# EAGLE design avr-smps (EAGLE 5.11)
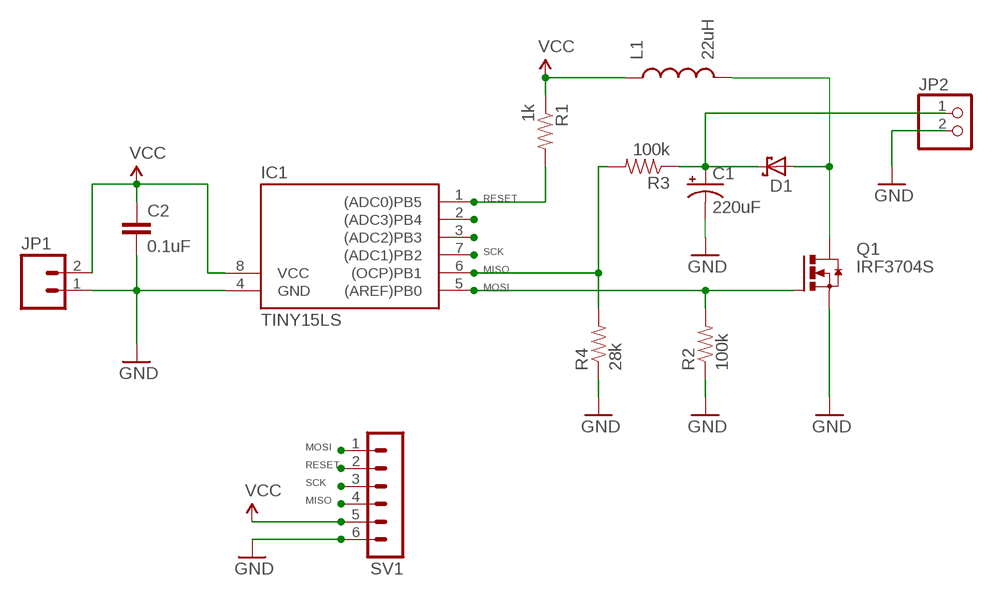
[diagram p0: schematic, sheet 1]

## Parts
C1  220uF  CPOL-US153CLV-0605  [153CLV-0605]
C2  0.1uF  CAP1206  [1206]
D1  SCHOTTKY-DIODESMD  [SMB]
IC1  TINY15LS  [SOIC8]
JP1  M02-JST-2MM-SMT  [JST-2-SMD]
JP2  PINHD-1X2  [1X02]
L1  22uH  INDUCTOR1210  [1210]
Q1  IRF3704S  [D2PACK]
R1  1k  RESISTOR1206  [1206]
R2  100k  RESISTOR1206  [1206]
R3  100k  RESISTOR1206  [1206]
R4  28k  RESISTOR1206  [1206]
SV1  MA06-1  [MA06-1]

## Nets
GND: C1.- C2.2 IC1.4(GND) JP1.1 JP2.2 Q1.3(S) R2.1 R4.1 SV1.6
MISO: IC1.6((OCP)PB1) R3.2 R4.2 SV1.4
MOSI: IC1.5((AREF)PB0) Q1.1(G) R2.2 SV1.1
N$1: IC1.3((ADC2)PB3)
N$2: D1.A L1.2 Q1.2(D)
N$4: C1.+ D1.C JP2.1 R3.1
N$5: IC1.2((ADC3)PB4)
RESET: IC1.1((ADC0)PB5) R1.2 SV1.2
SCK: IC1.7((ADC1)PB2) SV1.3
VCC: C2.1 IC1.8(VCC) JP1.2 L1.1 R1.1 SV1.5

## Notes on the sheet
- RESET
- SCK
- MISO
- MOSI
- MOSI
- RESET
- SCK
- MISO

## Library data of the parts
C1 = rcl:CPOL-US: POLARIZED CAPACITOR, American symbol
C2 = SparkFun:CAP: Capacitor Standard 0603 ceramic capacitor, and 0.1" leaded capacitor.
D1 = diode:SCHOTTKY-DIODE: Schottky Diode
IC1 = atmel:TINY15L: MICROCONTROLLER 2.7 V 1 Kbytes FLASH 64 bytes EEPROM 4-channel 10 bit ADC; OC_FARNELL: unknown; OC_NEWARK: unknown
JP1 = SparkFun:M02: Header 2 Standard 2-pin 0.1" header. Use with straight break away headers (SKU : PRT-00116), right angle break away headers (PRT-00553), swiss pins (PRT-00743), machine pins (PRT-00117), and female headers (PRT-00115). Molex polarized connector foot print use with SKU : PRT-08233 with associated crimp pins and housings.
JP2 = pinhead:PINHD-1X2: PIN HEADER
L1 = SparkFun:INDUCTOR: Inductors Basic Inductor/Choke - 0603 and 1206. Footprints are not proven and vary greatly between part numbers.
Q1 = transistor-power:IRF3704: SMPS MOSFET HEXFET® Power MOSFET Source: http://www.irf.com/product-info/datasheets/data/irf3704.pdf
R1-R4 = SparkFun:RESISTOR: Resistor Basic schematic elements and footprints for 0603, 1206, and PTH resistors.
SV1 = con-lstb:MA06-1: PIN HEADER; OC_FARNELL: unknown; OC_NEWARK: unknown

## Board
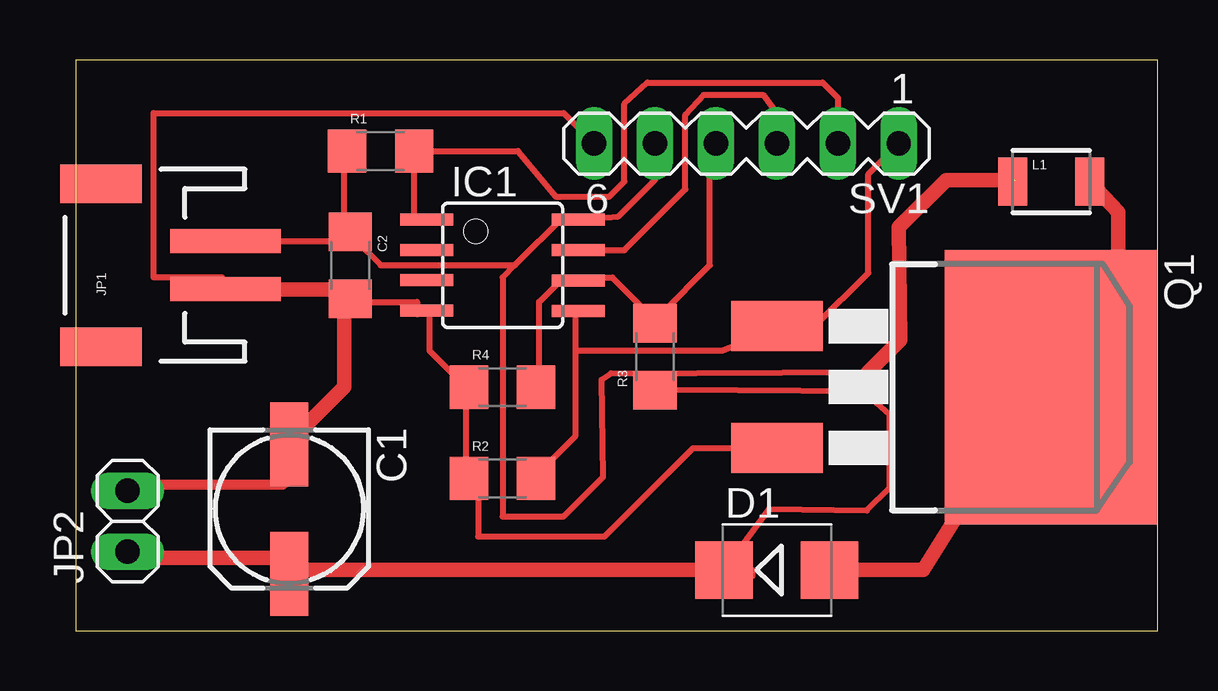
[diagram p1: board, top side]

Size 45.07 x 23.8 mm. Coordinates in mm from the lower left corner, seen from the top.
Outline: 0,0 45.07,0 45.07,23.8 0,23.8 0,0
Copper layers (1*16): Top 0.035mm / dielectric 1.5mm / Bottom 0.035mm
Design rules "default": minimum track width 10mil, minimum drill 24mil, track to track 8mil, track to pad 8mil, pad to pad 8mil, via to via 8mil, smd to smd 8mil, copper to edge 40mil, drill to drill 8mil, minimum pad ring 10mil, minimum via ring 8mil, stop-mask expansion 4mil, vias tented up to drill 0mil, thermal gap 10mil

### Footprints (pad centres in the part's own frame; a part is rotated, then mirrored left to right if it is on the bottom)
153CLV-0605 = smd 3.5 x 1.6: + 2.7,0; - -2.7,0
1206 = smd 1.6 x 1.8: 1 -1.4,0; 2 1.4,0
SMB = smd 2.4 x 2.4: A 2.2,0; C -2.2,0
SOIC8 = smd 0.5 x 2.2: 1 -1.905,-3.154; 2 -0.645,-3.154; 3 0.625,-3.154; 4 1.895,-3.154; 5 1.905,3.154; 6 0.635,3.154; 7 -0.635,3.154; 8 -1.905,3.154
JST-2-SMD = smd 1 x 4.6: 1 -1,-3.7; 2 1,-3.7 | smd 1.6 x 3.4: NC1 -3.4,1.5; NC2 3.4,1.5
1X02 = drill 1.016 long: 1 -1.27,0; 2 1.27,0
1210 = smd 1.2 x 2: 1 -1.6,0; 2 1.6,0
D2PACK = smd 2.083 x 3.81: 1 -2.54,-8.89; 3 2.54,-8.89 | smd 11.43 x 8.89: 2 0,2.54
MA06-1 = drill 1.016 long: 1 -6.35,0; 2 -3.81,0; 3 -1.27,0; 4 1.27,0; 5 3.81,0; 6 6.35,0

### Placement (x,y rotation side)
C1  8.89,5.08 270 top
C2  11.43,15.24 270 top
D1  29.21,2.54 0 top
IC1  17.78,15.24 270 top
JP1  2.54,15.24 90 top
JP2  2.16,4.57 90 top
L1  40.64,18.73 0 top
Q1  38.1,10.16 270 top
R1  12.7,20 0 top
R2  17.78,6.35 0 top
R3  24.13,11.43 90 top
R4  17.78,10.16 0 top
SV1  27.94,20.32 180 top

### Tracks (layer width: path | path; a pad name or v marks a point on that pad's centre or on a via)
GND
  Top 0.254: SV1.6 20.32,21.59 3.24,21.59 3.24,14.73 6.1,14.73 JP1.1 6.6,14.22 | 8.64,6.1 8.64,7.62 C1.- 9.14,8.13 | JP2.2 1.52,6.1 | 16.26,10.16 16.26,6.6 R2.1 16.76,6.1 16.76,3.94 22.04,3.94 25.72,7.62 Q1.3 | C2.2 11.68,13.72 14.22,13.72 14.22,13.21 IC1.4 14.73,13.21 14.73,11.68 16.26,10.16 | 16.26,10.16 R4.1 | 11.18,13.72 C2.2 | C2.2 11.18,14.22
  Top 0.406: 1.52,6.1 8.64,6.1
  Top 0.61: 9.14,8.13 11.18,10.16 11.18,13.72 | 11.18,14.22 6.6,14.22
MISO
  Top 0.254: R4.2 19.3,10.16 19.3,13.72 20.32,14.73 20.83,14.73 IC1.6 21.34,14.73 22.35,14.73 23.88,13.21 R3.2 24.38,13.21 26.42,15.24 26.42,20.32 SV1.4
MOSI
  Top 0.254: 20.83,11.68 20.83,13.21 IC1.5 | 20.83,11.68 20.83,8.13 19.3,6.6 R2.2 | SV1.1 33.02,19.05 33.02,14.92 30.8,12.7 Q1.1 30.48,13.46 29.78,12.83 26.92,11.68 20.83,11.68
N$2
  Top 0.254: 43.43,12.06 Q1.2 41.66,12.7
  Top 0.61: 43.43,12.06 43.43,17.46 L1.2 | 41.66,12.7 35.31,2.54 D1.A
N$4
  Top 0.254: 8.64,3.05 8.64,2.54 C1.+ 9.14,2.54 | JP2.1 1.52,3.05 | R3.1 24.96,10.03 32.83,9.97 33.91,9.02 33.91,5.97 32.96,5.02 28.89,5.08 D1.C | D1.C 28.19,2.54 28.19,2.29 D1.C
  Top 0.61: 1.52,3.05 8.64,3.05 | 9.14,2.54 D1.C
RESET
  Top 0.254: IC1.1 14.1,17.14 14.1,20.19 R1.2 18.41,20 20,18.1 22.23,18.1 22.86,18.73 22.86,21.97 23.81,22.86 31.11,22.86 31.75,22.23 SV1.2
SCK
  Top 0.254: IC1.7 20.83,15.88 | IC1.7 22.86,15.88 25.4,18.41 25.4,21.53 26.16,22.35 28.64,22.35 29.21,21.59 SV1.3 | 21.78,15.75 21.34,15.75 IC1.7
VCC  (1 unrouted)
  Top 0.254: R1.1 11.18,20.32 11.18,16.76 C2.1 | C2.1 11.18,16.26 6.6,16.26 JP1.2 | 33.02,10.79 22.29,10.73 21.91,10.48 21.97,6.41 20.32,4.76 17.78,4.76 17.78,14.73 18.29,15.24 | 18.29,15.24 20.32,17.27 20.83,17.27 IC1.8 22.61,17.27 24.13,18.8 SV1.5 | L1.1 38.61,19.11 | 18.29,15.24 12.7,15.24 11.68,16.26 C2.1
  Top 0.61: 33.02,10.79 34.35,12.13 34.29,16.83 36.26,18.8 39.12,18.8